# EAGLE schematic sn74ahc125-breakout (EAGLE 5.10)
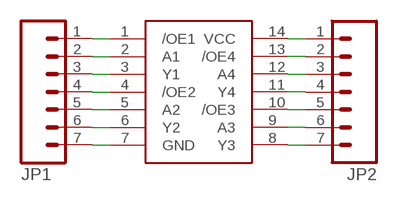
[diagram p0: schematic, sheet 1]

## Parts
JP1  M07LOCK_LONGPADS  [1X07_LOCK_LONGPADS]
JP2  M07LOCK_LONGPADS  [1X07_LOCK_LONGPADS]
U$1  SN74AHC125  [SO14]

## Nets
N$1: JP1.1 U$1.1(/OE1)
N$2: JP1.2 U$1.2(A1)
N$3: JP1.3 U$1.3(Y1)
N$4: JP1.4 U$1.4(/OE2)
N$5: JP1.5 U$1.5(A2)
N$6: JP1.6 U$1.6(Y2)
N$7: JP1.7 U$1.7(GND)
N$8: JP2.1 U$1.14(VCC)
N$9: JP2.2 U$1.13(/OE4)
N$10: JP2.3 U$1.12(A4)
N$11: JP2.4 U$1.11(Y4)
N$12: JP2.5 U$1.10(/OE3)
N$13: JP2.6 U$1.9(A3)
N$14: JP2.7 U$1.8(Y3)

## Library data of the parts
JP1 JP2 = SparkFun:M07: Header 7 Standard 7-pin 0.1" header. Use with straight break away headers (SKU : PRT-00116), right angle break away headers (PRT-00553), swiss pins (PRT-00743), machine pins (PRT-00117), and female headers (PRT-00115). NOTES ON THE VARIANTS LOCK and LOCK_LONGPADS... This footprint was designed to help hold the alignment of a through-hole component (i.e. 7-pin header) while soldering it into place. You may notice that each hole has been shifted either up or down by 0.005 of an inch from it's more standard position (which is usually a perfectly straight line). This slight alteration caused the pins (the squares in the middle) to touch the edges of the holes. Because they are alternating, it causes a "brace" to hold the header in place. 0.005 has proven to be the perfect amount of "off-center" position when using our standard breakaway headers. Although looks a little odd when you look at the bare footprint, once you have a header in there, the alteration is very hard to notice. Also, if you push a header all the way into place, it is covered up entirely on the bottom side. This idea of altering the position of holes to aid alignment will be further integrated into the Sparkfun Library for other footprints. It can help hold any component with 3 or more connection pins.
U$1 = ideabot:SN74AHC125